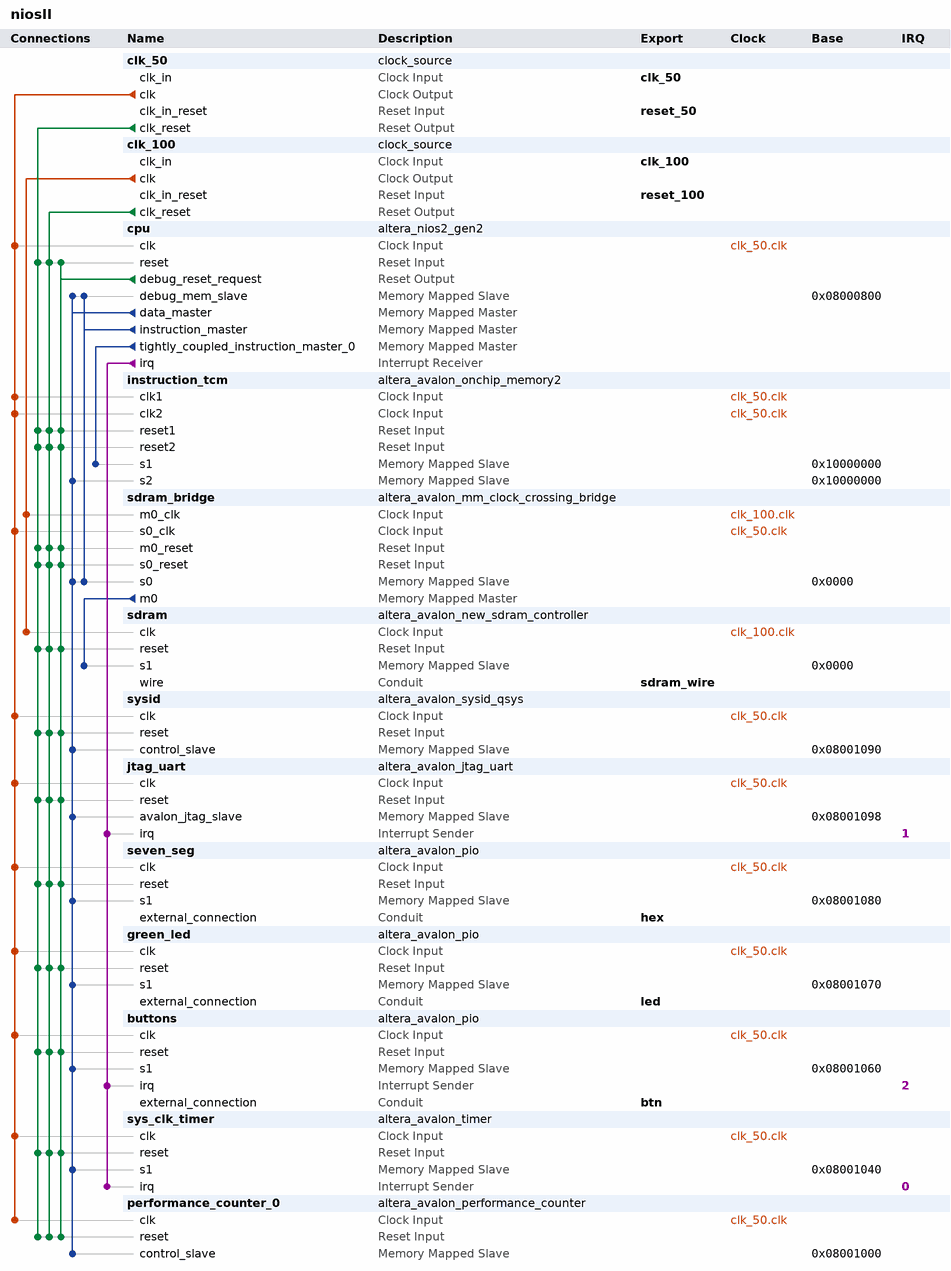
[diagram p0: system contents]
# Platform Designer (Qsys) system niosII, Cyclone IV E EP4CE115F29C7
# Parameters at their usual value, and those the tool derives, are not listed.
package require -exact qsys 20.1
create_system niosII
set_project_property DEVICE_FAMILY {Cyclone IV E}
set_project_property DEVICE EP4CE115F29C7

add_instance clk_50 clock_source 20.1
set_instance_parameter_value clk_50 clockFrequency 50000000

add_instance clk_100 clock_source 20.1
set_instance_parameter_value clk_100 clockFrequency 100000000

add_instance cpu altera_nios2_gen2 20.1
set_instance_parameter_value cpu dcache_bursts true
set_instance_parameter_value cpu dcache_size 4096
set_instance_parameter_value cpu debug_datatrigger 2
set_instance_parameter_value cpu debug_hwbreakpoint 2
set_instance_parameter_value cpu debug_traceType instruction_trace
set_instance_parameter_value cpu exceptionSlave sdram.s1
set_instance_parameter_value cpu icache_burstType Sequential
set_instance_parameter_value cpu icache_numTCIM 1
set_instance_parameter_value cpu icache_size 4096
set_instance_parameter_value cpu impl Fast
set_instance_parameter_value cpu resetSlave sdram.s1

add_instance instruction_tcm altera_avalon_onchip_memory2 20.1
set_instance_parameter_value instruction_tcm dataWidth 32
set_instance_parameter_value instruction_tcm dualPort true
set_instance_parameter_value instruction_tcm initMemContent true
set_instance_parameter_value instruction_tcm initializationFileName onchip_mem.hex
set_instance_parameter_value instruction_tcm memorySize 16384

add_instance sdram_bridge altera_avalon_mm_clock_crossing_bridge 20.1
set_instance_parameter_value sdram_bridge ADDRESS_WIDTH 10
set_instance_parameter_value sdram_bridge COMMAND_FIFO_DEPTH 4
set_instance_parameter_value sdram_bridge DATA_WIDTH 32
set_instance_parameter_value sdram_bridge MASTER_SYNC_DEPTH 2
set_instance_parameter_value sdram_bridge MAX_BURST_SIZE 16
set_instance_parameter_value sdram_bridge RESPONSE_FIFO_DEPTH 32
set_instance_parameter_value sdram_bridge SLAVE_SYNC_DEPTH 2
set_instance_parameter_value sdram_bridge USE_AUTO_ADDRESS_WIDTH 1

add_instance sdram altera_avalon_new_sdram_controller 20.1
set_instance_parameter_value sdram TAC 5.5
set_instance_parameter_value sdram TRCD 20.0
set_instance_parameter_value sdram TRP 20.0
set_instance_parameter_value sdram casLatency 3
set_instance_parameter_value sdram columnWidth 10
set_instance_parameter_value sdram dataWidth 32
set_instance_parameter_value sdram generateSimulationModel false
set_instance_parameter_value sdram model single_Micron_MT48LC4M32B2_7_chip
set_instance_parameter_value sdram numberOfBanks 4
set_instance_parameter_value sdram numberOfChipSelects 1
set_instance_parameter_value sdram powerUpDelay 100.0
set_instance_parameter_value sdram refreshPeriod 15.625
set_instance_parameter_value sdram rowWidth 13

add_instance sysid altera_avalon_sysid_qsys 20.1
set_instance_parameter_value sysid id 0

add_instance jtag_uart altera_avalon_jtag_uart 20.1
set_instance_parameter_value jtag_uart simInteractiveOptions NO_INTERACTIVE_WINDOWS

add_instance seven_seg altera_avalon_pio 20.1
set_instance_parameter_value seven_seg direction Output
set_instance_parameter_value seven_seg resetValue 4294967295
set_instance_parameter_value seven_seg width 32

add_instance green_led altera_avalon_pio 20.1
set_instance_parameter_value green_led direction Output
set_instance_parameter_value green_led width 8

add_instance buttons altera_avalon_pio 20.1
set_instance_parameter_value buttons captureEdge true
set_instance_parameter_value buttons direction Input
set_instance_parameter_value buttons edgeType FALLING
set_instance_parameter_value buttons generateIRQ true
set_instance_parameter_value buttons irqType EDGE
set_instance_parameter_value buttons width 4

add_instance sys_clk_timer altera_avalon_timer 20.1
set_instance_parameter_value sys_clk_timer period 1
set_instance_parameter_value sys_clk_timer periodUnits MSEC

add_instance performance_counter_0 altera_avalon_performance_counter 20.1
set_instance_parameter_value performance_counter_0 numberOfSections 3

# connections
add_connection clk_50.clk buttons.clk clock
add_connection clk_50.clk cpu.clk clock
add_connection clk_50.clk green_led.clk clock
add_connection clk_50.clk instruction_tcm.clk1 clock
add_connection clk_50.clk instruction_tcm.clk2 clock
add_connection clk_50.clk jtag_uart.clk clock
add_connection clk_50.clk performance_counter_0.clk clock
add_connection clk_50.clk sdram_bridge.s0_clk clock
add_connection clk_50.clk seven_seg.clk clock
add_connection clk_50.clk sys_clk_timer.clk clock
add_connection clk_50.clk sysid.clk clock
add_connection clk_100.clk sdram.clk clock
add_connection clk_100.clk sdram_bridge.m0_clk clock
add_connection clk_50.clk_reset buttons.reset reset
add_connection clk_50.clk_reset cpu.reset reset
add_connection clk_50.clk_reset green_led.reset reset
add_connection clk_50.clk_reset instruction_tcm.reset1 reset
add_connection clk_50.clk_reset instruction_tcm.reset2 reset
add_connection clk_50.clk_reset jtag_uart.reset reset
add_connection clk_50.clk_reset performance_counter_0.reset reset
add_connection clk_50.clk_reset sdram.reset reset
add_connection clk_50.clk_reset sdram_bridge.m0_reset reset
add_connection clk_50.clk_reset sdram_bridge.s0_reset reset
add_connection clk_50.clk_reset seven_seg.reset reset
add_connection clk_50.clk_reset sys_clk_timer.reset reset
add_connection clk_50.clk_reset sysid.reset reset
add_connection clk_100.clk_reset buttons.reset reset
add_connection clk_100.clk_reset cpu.reset reset
add_connection clk_100.clk_reset green_led.reset reset
add_connection clk_100.clk_reset instruction_tcm.reset1 reset
add_connection clk_100.clk_reset instruction_tcm.reset2 reset
add_connection clk_100.clk_reset jtag_uart.reset reset
add_connection clk_100.clk_reset performance_counter_0.reset reset
add_connection clk_100.clk_reset sdram.reset reset
add_connection clk_100.clk_reset sdram_bridge.m0_reset reset
add_connection clk_100.clk_reset sdram_bridge.s0_reset reset
add_connection clk_100.clk_reset seven_seg.reset reset
add_connection clk_100.clk_reset sys_clk_timer.reset reset
add_connection clk_100.clk_reset sysid.reset reset
add_connection cpu.debug_reset_request buttons.reset reset
add_connection cpu.debug_reset_request cpu.reset reset
add_connection cpu.debug_reset_request green_led.reset reset
add_connection cpu.debug_reset_request instruction_tcm.reset1 reset
add_connection cpu.debug_reset_request instruction_tcm.reset2 reset
add_connection cpu.debug_reset_request jtag_uart.reset reset
add_connection cpu.debug_reset_request performance_counter_0.reset reset
add_connection cpu.debug_reset_request sdram.reset reset
add_connection cpu.debug_reset_request sdram_bridge.m0_reset reset
add_connection cpu.debug_reset_request sdram_bridge.s0_reset reset
add_connection cpu.debug_reset_request seven_seg.reset reset
add_connection cpu.debug_reset_request sys_clk_timer.reset reset
add_connection cpu.debug_reset_request sysid.reset reset
add_connection cpu.data_master buttons.s1 avalon
set_connection_parameter_value cpu.data_master/buttons.s1 baseAddress 0x08001060
add_connection cpu.data_master cpu.debug_mem_slave avalon
set_connection_parameter_value cpu.data_master/cpu.debug_mem_slave baseAddress 0x08000800
add_connection cpu.data_master green_led.s1 avalon
set_connection_parameter_value cpu.data_master/green_led.s1 baseAddress 0x08001070
add_connection cpu.data_master instruction_tcm.s2 avalon
set_connection_parameter_value cpu.data_master/instruction_tcm.s2 baseAddress 0x10000000
add_connection cpu.data_master jtag_uart.avalon_jtag_slave avalon
set_connection_parameter_value cpu.data_master/jtag_uart.avalon_jtag_slave baseAddress 0x08001098
add_connection cpu.data_master performance_counter_0.control_slave avalon
set_connection_parameter_value cpu.data_master/performance_counter_0.control_slave baseAddress 0x08001000
add_connection cpu.data_master sdram_bridge.s0 avalon
set_connection_parameter_value cpu.data_master/sdram_bridge.s0 baseAddress 0x0000
add_connection cpu.data_master seven_seg.s1 avalon
set_connection_parameter_value cpu.data_master/seven_seg.s1 baseAddress 0x08001080
add_connection cpu.data_master sys_clk_timer.s1 avalon
set_connection_parameter_value cpu.data_master/sys_clk_timer.s1 baseAddress 0x08001040
add_connection cpu.data_master sysid.control_slave avalon
set_connection_parameter_value cpu.data_master/sysid.control_slave baseAddress 0x08001090
add_connection cpu.instruction_master cpu.debug_mem_slave avalon
set_connection_parameter_value cpu.instruction_master/cpu.debug_mem_slave baseAddress 0x08000800
add_connection cpu.instruction_master sdram_bridge.s0 avalon
set_connection_parameter_value cpu.instruction_master/sdram_bridge.s0 baseAddress 0x0000
add_connection cpu.tightly_coupled_instruction_master_0 instruction_tcm.s1 avalon
set_connection_parameter_value cpu.tightly_coupled_instruction_master_0/instruction_tcm.s1 baseAddress 0x10000000
add_connection sdram_bridge.m0 sdram.s1 avalon
set_connection_parameter_value sdram_bridge.m0/sdram.s1 baseAddress 0x0000
add_connection cpu.irq buttons.irq interrupt
set_connection_parameter_value cpu.irq/buttons.irq irqNumber 2
add_connection cpu.irq jtag_uart.irq interrupt
set_connection_parameter_value cpu.irq/jtag_uart.irq irqNumber 1
add_connection cpu.irq sys_clk_timer.irq interrupt
set_connection_parameter_value cpu.irq/sys_clk_timer.irq irqNumber 0

# exported interfaces
add_interface btn conduit end
set_interface_property btn EXPORT_OF buttons.external_connection
add_interface clk_100 clock sink
set_interface_property clk_100 EXPORT_OF clk_100.clk_in
add_interface clk_50 clock sink
set_interface_property clk_50 EXPORT_OF clk_50.clk_in
add_interface hex conduit end
set_interface_property hex EXPORT_OF seven_seg.external_connection
add_interface led conduit end
set_interface_property led EXPORT_OF green_led.external_connection
add_interface reset_100 reset sink
set_interface_property reset_100 EXPORT_OF clk_100.clk_in_reset
add_interface reset_50 reset sink
set_interface_property reset_50 EXPORT_OF clk_50.clk_in_reset
add_interface sdram_wire conduit end
set_interface_property sdram_wire EXPORT_OF sdram.wire

set_interconnect_requirement {$system} qsys_mm.clockCrossingAdapter HANDSHAKE
set_interconnect_requirement {$system} qsys_mm.enableEccProtection FALSE
set_interconnect_requirement {$system} qsys_mm.insertDefaultSlave FALSE
set_interconnect_requirement {$system} qsys_mm.maxAdditionalLatency 1

save_system niosII.qsys
